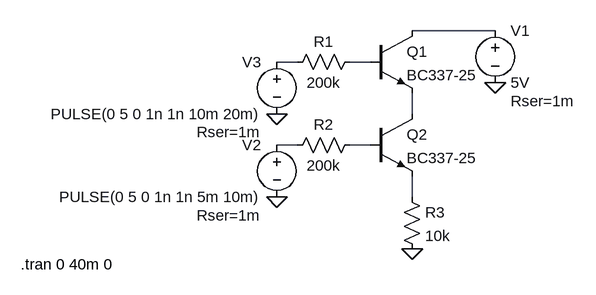
[diagram p0: schematic latch_nand.asc]
latch_nand.asc, the LTspice schematic file:
Version 4
SHEET 1 880 680
WIRE 304 64 176 64
WIRE 0 112 -32 112
WIRE 112 112 80 112
WIRE 176 192 176 160
WIRE 0 240 -32 240
WIRE 112 240 80 240
WIRE 176 320 176 288
FLAG 304 144 0
FLAG 176 400 0
FLAG -32 320 0
FLAG -32 192 0
SYMBOL npn 112 64 R0
SYMATTR InstName Q1
SYMATTR Value BC337-25
SYMBOL npn 112 192 R0
SYMATTR InstName Q2
SYMATTR Value BC337-25
SYMBOL voltage 304 48 R0
WINDOW 123 0 0 Left 2
WINDOW 39 24 124 Left 2
SYMATTR InstName V1
SYMATTR Value 5V
SYMATTR SpiceLine Rser=1m
SYMBOL res 96 96 R90
WINDOW 0 0 56 VBottom 2
WINDOW 3 32 56 VTop 2
SYMATTR InstName R1
SYMATTR Value 200k
SYMBOL res 96 224 R90
WINDOW 0 0 56 VBottom 2
WINDOW 3 32 56 VTop 2
SYMATTR InstName R2
SYMATTR Value 200k
SYMBOL res 160 304 R0
SYMATTR InstName R3
SYMATTR Value 10k
SYMBOL voltage -32 224 M0
WINDOW 123 0 0 Left 2
WINDOW 39 24 124 Left 2
SYMATTR InstName V2
SYMATTR Value PULSE(0 5 0 1n 1n 5m 10m)
SYMATTR SpiceLine Rser=1m
SYMBOL voltage -32 96 M0
WINDOW 123 0 0 Left 2
WINDOW 39 24 124 Left 2
SYMATTR InstName V3
SYMATTR Value PULSE(0 5 0 1n 1n 10m 20m)
SYMATTR SpiceLine Rser=1m
TEXT -426 424 Left 2 !.tran 0 40m 0

The netlist it stands for:
* latch_nand.asc
Q1 N001 N003 N004 0 BC337-25
Q2 N004 N006 N007 0 BC337-25
V1 N001 0 5V Rser=1m
R1 N003 N002 200k
R2 N006 N005 200k
R3 N007 0 10k
V2 N005 0 PULSE(0 5 0 1n 1n 5m 10m) Rser=1m
V3 N002 0 PULSE(0 5 0 1n 1n 10m 20m) Rser=1m
.model NPN NPN
.model PNP PNP
.lib standard.bjt
.tran 0 40m 0
.backanno
.end